# EAGLE design Garage_Door_Controller (EAGLE 9.6.2)
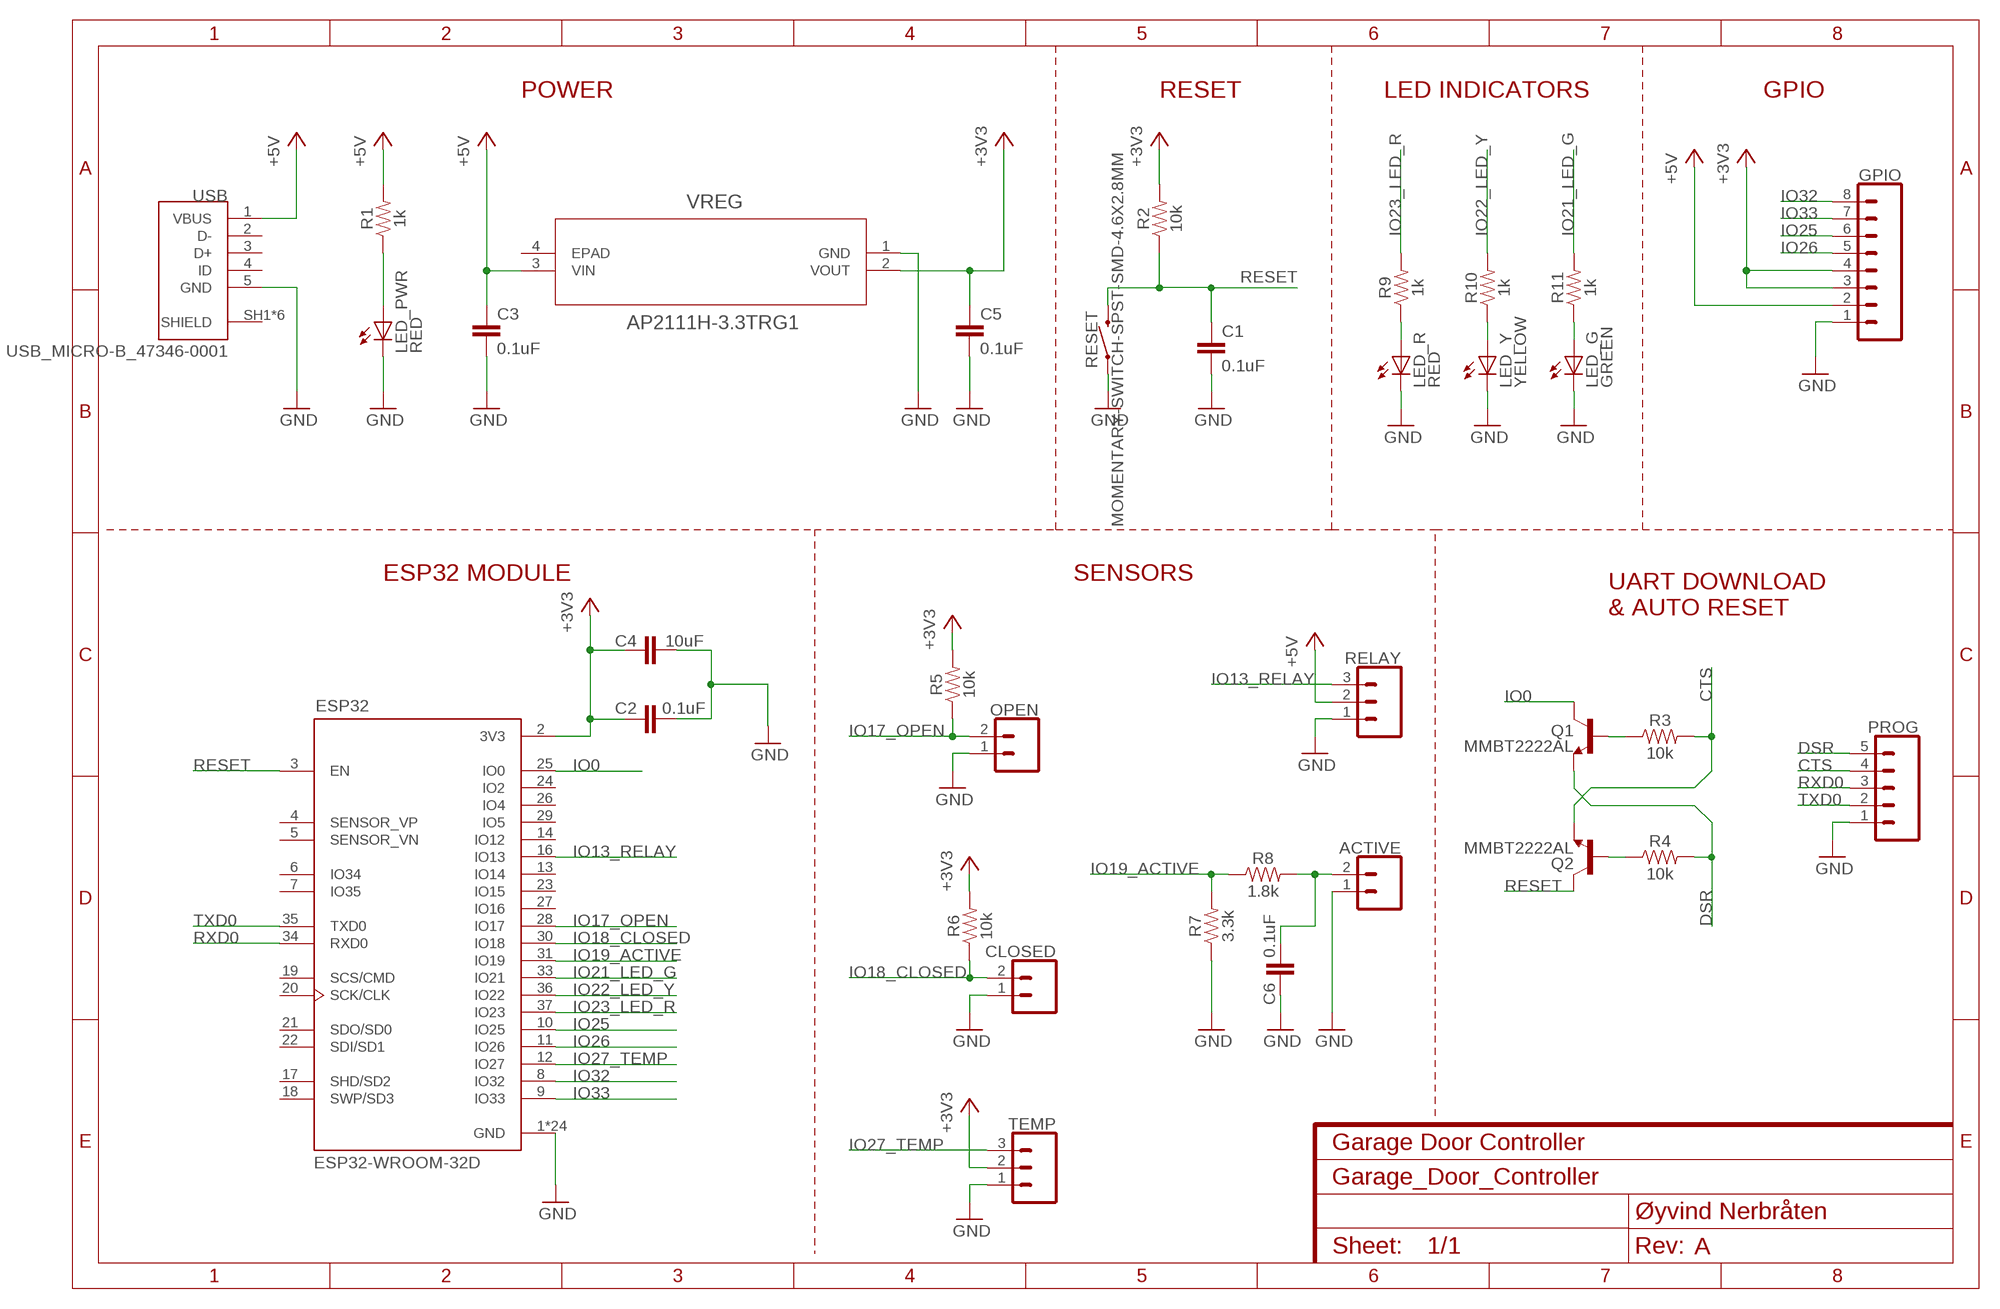
[diagram p0: schematic, sheet 1]
FRAME1 (FRAME-A4L): CNAME: Garage Door Controller; CREVISION: A; DESIGNER: Øyvind Nerbråten; REV: 1

## Parts
ACTIVE  CONN_02  [1X02]
C1  0.1uF  0.1UF-0603-25V-5%  [0603]
C2  0.1uF  0.1UF-0603-25V-5%  [0603]
C3  0.1uF  0.1UF-0603-25V-5%  [0603]
C4  10uF  10UF-0805-10V-10%  [0805]
C5  0.1uF  0.1UF-0603-25V-5%  [0603]
C6  0.1uF  0.1UF-0603-25V-5%  [0603]
CLOSED  CONN_02  [1X02]
ESP32  ESP32-WROOM-32D  [ESP32-WROOM-32D]
GPIO  CONN_08"  [1X08]
LED_G  GREEN  LEDCHIPLED_0805  [CHIPLED_0805]
LED_PWR  RED  LEDCHIPLED_0805  [CHIPLED_0805]
LED_R  RED  LEDCHIPLED_0805  [CHIPLED_0805]
LED_Y  YELLOW  LEDCHIPLED_0805  [CHIPLED_0805]
OPEN  CONN_02  [1X02]
PROG  CONN_05  [1X05]
Q1  MMBT2222AL  TRANS_NPN-MMBT2222AL  [SOT23-3]
Q2  MMBT2222AL  TRANS_NPN-MMBT2222AL  [SOT23-3]
R1  1k  1KOHM-0603-1/10W-1%  [0603]
R2  10k  10KOHM-0603-1/10W-1%  [0603]
R3  10k  10KOHM-0603-1/10W-1%  [0603]
R4  10k  10KOHM-0603-1/10W-1%  [0603]
R5  10k  10KOHM-0603-1/10W-1%  [0603]
R6  10k  10KOHM-0603-1/10W-1%  [0603]
R7  3.3k  3.3KOHM-0603-1/10W-1%  [0603]
R8  1.8k  1.8KOHM-0603-1/10W-1%  [0603]
R9  1k  1KOHM-0603-1/10W-1%  [0603]
R10  1k  1KOHM-0603-1/10W-1%  [0603]
R11  1k  1KOHM-0603-1/10W-1%  [0603]
RELAY  CONN_03  [1X03]
RESET  MOMENTARY-SWITCH-SPST-SMD-4.6X2.8MM  [TACTILE_SWITCH_SMD_4.6X2.8MM]
TEMP  CONN_03  [1X03]
USB  USB_MICRO-B_47346-0001  [MOLEX_47346-0001]
VREG  AP2111H-3.3TRG1  [SOT-223_DIO]

## Nets
+3V3: C2.1 C4.1 C5.1 ESP32.2(3V3) GPIO.3 GPIO.4 R2.2 R5.2 R6.2 TEMP.2 VREG.2(VOUT)
+5V: C3.1 GPIO.2 R1.2 RELAY.2 USB.1(VBUS) VREG.3(VIN)
CTS: PROG.4 Q2.2(E) R3.2
DSR: PROG.5 Q1.2(E) R4.2
GND: ACTIVE.1 C1.2 C2.2 C3.2 C4.2 C5.2 C6.1 CLOSED.1 ESP32.1(GND) ESP32.15(GND) ESP32.38(GND) ESP32.39_1(GND) ESP32.39_2(GND) ESP32.39_3(GND) ESP32.39_4(GND) ESP32.39_5(GND) ESP32.39_6(GND) ESP32.39_7(GND) ESP32.39_8(GND) ESP32.39_9(GND) ESP32.39_10(GND) ESP32.39_11(GND) ESP32.39_12(GND) ESP32.39_13(GND) ESP32.39_14(GND) ESP32.39_15(GND) ESP32.39_16(GND) ESP32.39_17(GND) ESP32.39_18(GND) ESP32.39_19(GND) ESP32.39_20(GND) ESP32.39_21(GND) GPIO.1 LED_G.C LED_PWR.C LED_R.C LED_Y.C OPEN.1 PROG.1 R7.1 RELAY.1 RESET.1 RESET.2 TEMP.1 USB.5(GND) VREG.1(GND)
IO0: ESP32.25(IO0) Q1.3(C)
IO13_RELAY: ESP32.16(IO13) RELAY.3
IO17_OPEN: ESP32.28(IO17) OPEN.2 R5.1
IO18_CLOSED: CLOSED.2 ESP32.30(IO18) R6.1
IO19_ACTIVE: ESP32.31(IO19) R7.2 R8.1
IO21_LED_G: ESP32.33(IO21) R11.2
IO22_LED_Y: ESP32.36(IO22) R10.2
IO23_LED_R: ESP32.37(IO23) R9.2
IO25: ESP32.10(IO25) GPIO.6
IO26: ESP32.11(IO26) GPIO.5
IO27_TEMP: ESP32.12(IO27) TEMP.3
IO32: ESP32.8(IO32) GPIO.8
IO33: ESP32.9(IO33) GPIO.7
N$1: LED_PWR.A R1.1
N$2: Q1.1(B) R3.1
N$3: Q2.1(B) R4.1
N$4: ACTIVE.2 C6.2 R8.2
N$5: LED_R.A R9.1
N$6: LED_Y.A R10.1
N$7: LED_G.A R11.1
RESET: C1.1 ESP32.3(EN) Q2.3(C) R2.1 RESET.3 RESET.4
RXD0: ESP32.34(RXD0) PROG.3
TXD0: ESP32.35(TXD0) PROG.2
Unconnected: ESP32.4(SENSOR_VP) ESP32.5(SENSOR_VN) ESP32.6(IO34) ESP32.7(IO35) ESP32.13(IO14) ESP32.14(IO12) ESP32.17(SHD/SD2) ESP32.18(SWP/SD3) ESP32.19(SCS/CMD) ESP32.20(SCK/CLK) ESP32.21(SDO/SD0) ESP32.22(SDI/SD1) ESP32.23(IO15) ESP32.24(IO2) ESP32.26(IO4) ESP32.27(IO16) ESP32.29(IO5) USB.2(D-) USB.3(D+) USB.4(ID) USB.SH1(SHIELD) USB.SH2(SHIELD) USB.SH3(SHIELD) USB.SH4(SHIELD) USB.SH5(SHIELD) USB.SH6(SHIELD) VREG.4(EPAD)

## Notes on the sheet
- POWER | RESET | LED INDICATORS | GPIO
- ESP32 MODULE | SENSORS
- UART DOWNLOAD
  & AUTO RESET

## Library data of the parts
ACTIVE CLOSED OPEN = SparkFun-Connectors:CONN_02: Multi connection point. Often used as Generic Header-pin footprint for 0.1 inch spaced/style header connections On any of the 0.1 inch spaced packages, you can populate with these: Break Away Headers - Straight <https://www.sparkfun.com/products/116> (PRT-00116) Break Away Male Headers - Right Angle <https://www.sparkfun.com/products/553> (PRT-00553) Female Headers <https://www.sparkfun.com/products/115> (PRT-00115) Break Away Headers - Machine Pin <https://www.sparkfun.com/products/117> (PRT-00117) Break Away Female Headers - Swiss Machine Pin <https://www.sparkfun.com/products/743> (PRT-00743) For SCREWTERMINALS and SPRING TERMINALS visit here: Screw Terimnals on SparkFun.com <https://www.sparkfun.com/search/results?term=Screw+Terminals> (5mm/3.5mm/2.54mm spacing) This device is also useful as a general connection point to wire up your design to another part of your project. Our various solder wires solder well into these plated through hole pads. Hook-Up Wire - Assortment (Stranded, 22 AWG) <https://www.sparkfun.com/products/11375> (PRT-11375) Hook-Up Wire - Assortment (Solid Core, 22 AWG) <https://www.sparkfun.com/products/11367> (PRT-11367) View the entire wire category on our website here <https://www.sparkfun.com/categories/141> Special notes: Molex polarized connector foot print use with: PRT-08233 with associated crimp pins and housings. 2.54_SCREWTERM for use with PRT-10571. 3.5mm Screw Terminal footprints for PRT-08084 5mm Screw Terminal footprints for use with PRT-08432
C1-C3 C5 C6 = SparkFun-Capacitors:0.1UF: 0.1µF ceramic capacitors A capacitor is a passive two-terminal electrical component used to store electrical energy temporarily in an electric field.; PROD_ID: CAP-08604
C4 = SparkFun-Capacitors:10UF: 10.0µF ceramic capacitors A capacitor is a passive two-terminal electrical component used to store electrical energy temporarily in an electric field.; PROD_ID: CAP-11330
ESP32 = IC-Microcontroller:ESP32-WROOM-32D: Bluetooth, WiFi 802.11b/g/n, Bluetooth v4.2 + EDR, Class 1, 2 and 3 Transceiver Module 2.4GHz ~ 2.5GHz Integrated, Trace Surface Mount; AVAILABILITY: Unavailable; DESCRIPTION: Bluetooth, WiFi 802.11b/g/n, Bluetooth v4.2 + EDR, Class 1, 2 and 3 Transceiver Module 2.4GHz ~ 2.5GHz Integrated, Trace Surface Mount; MF: Espressif Systems; MP: ESP32-WROOM-32D; PACKAGE: Module Espressif Systems; PRICE: None
GPIO = SparkFun-Connectors:CONN_08: Multi connection point. Often used as Generic Header-pin footprint for 0.1 inch spaced/style header connections On any of the 0.1 inch spaced packages, you can populate with these: Break Away Headers - Straight <https://www.sparkfun.com/products/116> (PRT-00116) Break Away Male Headers - Right Angle <https://www.sparkfun.com/products/553> (PRT-00553) Female Headers <https://www.sparkfun.com/products/115> (PRT-00115) Break Away Headers - Machine Pin <https://www.sparkfun.com/products/117> (PRT-00117) Break Away Female Headers - Swiss Machine Pin <https://www.sparkfun.com/products/743> (PRT-00743) Arduino Stackable Header - 8 Pin <https://www.sparkfun.com/products/9279> (PRT-09279) For SCREWTERMINALS and SPRING TERMINALS visit here: Screw Terimnals on SparkFun.com <https://www.sparkfun.com/search/results?term=Screw+Terminals> (5mm/3.5mm/2.54mm spacing) This device is also useful as a general connection point to wire up your design to another part of your project. Our various solder wires solder well into these plated through hole pads. Hook-Up Wire - Assortment (Stranded, 22 AWG) <https://www.sparkfun.com/products/11375> (PRT-11375) Hook-Up Wire - Assortment (Solid Core, 22 AWG) <https://www.sparkfun.com/products/11367> (PRT-11367) View the entire wire category on our website here <https://www.sparkfun.com/categories/141> Special notes: Molex polarized connector foot print use with SKU : PRT-08231 with associated crimp pins and housings. 1MM SMD Version SKU: PRT-10208 NOTES ON THE VARIANTS LOCK and LOCK_LONGPADS... This footprint was designed to help hold the alignment of a through-hole component (i.e. 6-pin header) while soldering it into place. You may notice that each hole has been shifted either up or down by 0.005 of an inch from it's more standard position (which is a perfectly straight line). This slight alteration caused the pins (the squares in the middle) to touch the edges of the holes. Because they are alternating, it causes a "brace" to hold the component in place. 0.005 has proven to be the perfect amount of "off-center" position when using our standard breakaway headers. Although looks a little odd when you look at the bare footprint, once you have a header in there, the alteration is very hard to notice. Also,if you push a header all the way into place, it is covered up entirely on the bottom side.; PROD_ID: CONN-08438
LED_G LED_PWR LED_R LED_Y = adafruit:LED: LED OSRAM: - CHIPLED LG R971, LG N971, LY N971, LG Q971, LY Q971, LO R971, LY R971 LH N974, LH R974 LS Q976, LO Q976, LY Q976 LO Q996 - Hyper CHIPLED LW Q18S LB Q993, LB Q99A, LB R99A - SideLED LS A670, LO A670, LY A670, LG A670, LP A670 LB A673, LV A673, LT A673, LW A673 LH A674 LY A675 LS A676, LA A676, LO A676, LY A676, LW A676 LS A679, LY A679, LG A679 - Hyper Micro SIDELED® LS Y876, LA Y876, LO Y876, LY Y876 LT Y87S - SmartLED LW L88C, LW L88S LB L89C, LB L89S, LG L890 LS L89K, LO L89K, LY L89K LS L896, LA L896, LO L896, LY L896 - TOPLED LS T670, LO T670, LY T670, LG T670, LP T670 LSG T670, LSP T670, LSY T670, LOP T670, LYG T670 LG T671, LOG T671, LSG T671 LB T673, LV T673, LT T673, LW T673 LH T674 LS T676, LA T676, LO T676, LY T676, LB T676, LH T676, LSB T676, LW T676 LB T67C, LV T67C, LT T67C, LS T67K, LO T67K, LY T67K, LW E67C LS E67B, LA E67B, LO E67B, LY E67B, LB E67C, LV E67C, LT E67C LW T67C LS T679, LY T679, LG T679 LS T770, LO T770, LY T770, LG T770, LP T770 LB T773, LV T773, LT T773, LW T773 LH T774 LS E675, LA E675, LY E675, LS T675 LS T776, LA T776, LO T776, LY T776, LB T776 LHGB T686 LT T68C, LB T68C - Hyper Mini TOPLED® LB M676 - Mini TOPLED Santana® LG M470 LS M47K, LO M47K, LY M47K Source: http://www.osram.convergy.de/
PROG = SparkFun-Connectors:CONN_05: Multi connection point. Often used as Generic Header-pin footprint for 0.1 inch spaced/style header connections On any of the 0.1 inch spaced packages, you can populate with these: Break Away Headers - Straight <https://www.sparkfun.com/products/116> (PRT-00116) Break Away Male Headers - Right Angle <https://www.sparkfun.com/products/553> (PRT-00553) Female Headers <https://www.sparkfun.com/products/115> (PRT-00115) Break Away Headers - Machine Pin <https://www.sparkfun.com/products/117> (PRT-00117) Break Away Female Headers - Swiss Machine Pin <https://www.sparkfun.com/products/743> (PRT-00743) For SCREWTERMINALS and SPRING TERMINALS visit here: Screw Terimnals on SparkFun.com <https://www.sparkfun.com/search/results?term=Screw+Terminals> (5mm/3.5mm/2.54mm spacing) This device is also useful as a general connection point to wire up your design to another part of your project. Our various solder wires solder well into these plated through hole pads. Hook-Up Wire - Assortment (Stranded, 22 AWG) <https://www.sparkfun.com/products/11375> (PRT-11375) Hook-Up Wire - Assortment (Solid Core, 22 AWG) <https://www.sparkfun.com/products/11367> (PRT-11367) View the entire wire category on our website here <https://www.sparkfun.com/categories/141> Special notes: Molex polarized connector foot print use with SKU : PRT-08231 with associated crimp pins and housings. 1MM SMD Version SKU: PRT-10208
Q1 Q2 = SparkFun-DiscreteSemi:TRANS_NPN: NPN transistor Current controlled devices typically used to amplify current or used as a switch. BC547 - COM-08928 <http://www.sparkfun.com/products/8928> (TO-92 45V 100mA) (1.Collector 2.Base 3.Emitter) 2N3904 - COM-00521 <http://www.sparkfun.com/products/521> (TO-92 40V 200mA) (1.Emitter 2.Base 3.Collector) P2N2222A - COM-12852 <http://www.sparkfun.com/products/12852> (TO-92 40V 600mA) (1.Collector 2.Base 3.Emitter); PROD_ID: TRANS-08049; VALUE: 600mA/40V
R1 R9-R11 = SparkFun-Resistors:1KOHM: 1kΩ resistor A resistor is a passive two-terminal electrical component that implements electrical resistance as a circuit element. Resistors act to reduce current flow, and, at the same time, act to lower voltage levels within circuits. - Wikipedia; PROD_ID: RES-07856
R2-R6 = SparkFun-Resistors:10KOHM: 10kΩ resistor A resistor is a passive two-terminal electrical component that implements electrical resistance as a circuit element. Resistors act to reduce current flow, and, at the same time, act to lower voltage levels within circuits. - Wikipedia; PROD_ID: RES-00824
R7 = SparkFun-Resistors:3.3KOHM: 3.3kΩ resistor A resistor is a passive two-terminal electrical component that implements electrical resistance as a circuit element. Resistors act to reduce current flow, and, at the same time, act to lower voltage levels within circuits. - Wikipedia; PROD_ID: RES-07851
R8 = SparkFun-Resistors:1.8KOHM: 1.8kΩ resistor A resistor is a passive two-terminal electrical component that implements electrical resistance as a circuit element. Resistors act to reduce current flow, and, at the same time, act to lower voltage levels within circuits. - Wikipedia; PROD_ID: RES-09119
RELAY TEMP = SparkFun-Connectors:CONN_03: Multi connection point. Often used as Generic Header-pin footprint for 0.1 inch spaced/style header connections On any of the 0.1 inch spaced packages, you can populate with these: Break Away Headers - Straight <https://www.sparkfun.com/products/116> (PRT-00116) Break Away Male Headers - Right Angle <https://www.sparkfun.com/products/553> (PRT-00553) Female Headers <https://www.sparkfun.com/products/115> (PRT-00115) Break Away Headers - Machine Pin <https://www.sparkfun.com/products/117> (PRT-00117) Break Away Female Headers - Swiss Machine Pin <https://www.sparkfun.com/products/743> (PRT-00743) Stackable Header - 3 Pin (Female, 0.1") <https://www.sparkfun.com/products/13875> (PRT-13875) For SCREWTERMINALS and SPRING TERMINALS visit here: Screw Terimnals on SparkFun.com <https://www.sparkfun.com/search/results?term=Screw+Terminals> (5mm/3.5mm/2.54mm spacing) This device is also useful as a general connection point to wire up your design to another part of your project. Our various solder wires solder well into these plated through hole pads. Hook-Up Wire - Assortment (Stranded, 22 AWG) <https://www.sparkfun.com/products/11375> (PRT-11375) Hook-Up Wire - Assortment (Solid Core, 22 AWG) <https://www.sparkfun.com/products/11367> (PRT-11367) View the entire wire category on our website here <https://www.sparkfun.com/categories/141> Special notes: Molex polarized connector foot print use with SKU : PRT-08232 with associated crimp pins and housings.
RESET = SparkFun-Switches:MOMENTARY-SWITCH-SPST: Momentary Switch (Pushbutton) - SPST Normally-open (NO) SPST momentary switches (buttons, pushbuttons). Variants PTH-12MM - 12mm square, through-hole Momentary Pushbutton Switch - 12mm Square <https://www.sparkfun.com/products/9190> (COM-09190) PTH-6.0MM, PTH-6.0MM-KIT - 6.0mm square, through-hole Mini Pushbutton Switch <https://www.sparkfun.com/products/97> (COM-00097) KIT package intended for soldering kit's - only one side of pads' copper is exposed. PTH-RIGHT-ANGLE-KIT - Right-angle, through-hole Right Angle Tactile Button <https://www.sparkfun.com/products/10791> - Used on SparkFun BigTime Watch Kit <https://www.sparkfun.com/products/11734> SMD-12MM - 12mm square, surface-mount Tactile Button - SMD (12mm) <https://www.sparkfun.com/products/12993> (COM-12993) Used on SparkFun PicoBoard <https://www.sparkfun.com/products/11888> SMD-4.5MM - 4.5mm Square Trackball Switch Used on SparkFun Blackberry Trackballer Breakout <https://www.sparkfun.com/products/13169> SMD-4.6MMX2.8MM - 4.60mm x 2.80mm, surface mount Used on SparkFun SAMD21 Mini Breakout <https://www.sparkfun.com/products/13664> SMD-5.2MM, SMD-5.2-REDUNDANT - 5.2mm square, surface-mount Mini Pushbutton Switch - SMD <https://www.sparkfun.com/products/8720> (COM-08720) Used on Arduino Pro Mini <https://www.sparkfun.com/products/11114> REDUNDANT package connects both switch circuits together SMD-6.0X3.5MM - 6.0 x 3.5mm, surface mount Momentary Reset Switch SMD <https://www.sparkfun.com/products/8229> (COM-08229) SMD-6.2MM-TALL - 6.2mm square, surface mount Tactile Button - SMD (6mm) <https://www.sparkfun.com/products/12992> Used on SparkFun Digital Sandbox <https://www.sparkfun.com/products/12651> SMD-RIGHT-ANGLE - Right-angle, surface mount Used on SparkFun Block for Intel® Edison - Arduino <https://www.sparkfun.com/products/13036>; PROD_ID: SWCH-13065
USB = Connectors:USB_MICRO-B_47346-0001: CONN RCPT 5POS MICRO USB R/A SMD; AVAILABILITY: Unavailable; DESCRIPTION: USB - micro B USB 2.0 Receptacle Connector 5 Position Surface Mount, Right Angle; MF: Molex; MOUSER-PURCHASE-URL: https://snapeda.com/shop?store=Mouser&id=53503; MP: 47346-0001; PACKAGE: None; PRICE: None
VREG = IC-Power:AP2111H-3.3TRG1; BUILT_BY: EMA_UL_Team; MANUFACTURER_PART_NUMBER: AP2111H-3.3TRG1; SOURCELIBRARY: DIODESINC_2_2015-08-18; VENDOR: Diodes Inc

## Board
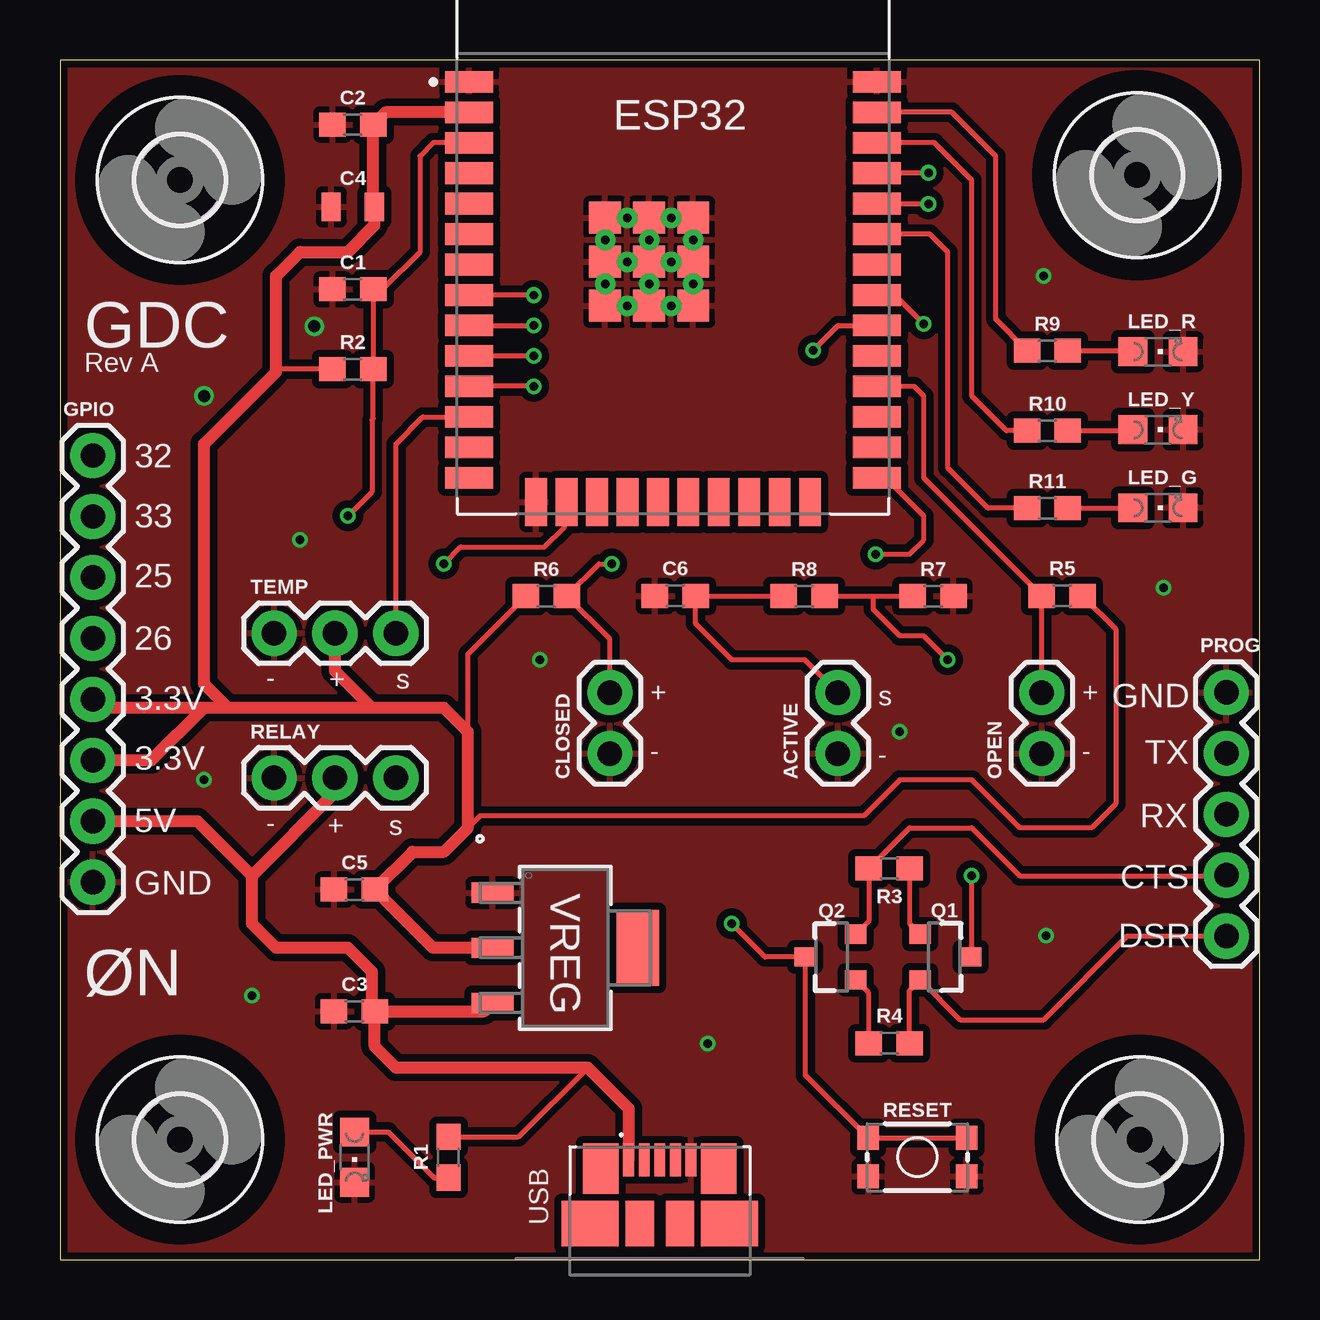
[diagram p1: board, top side]
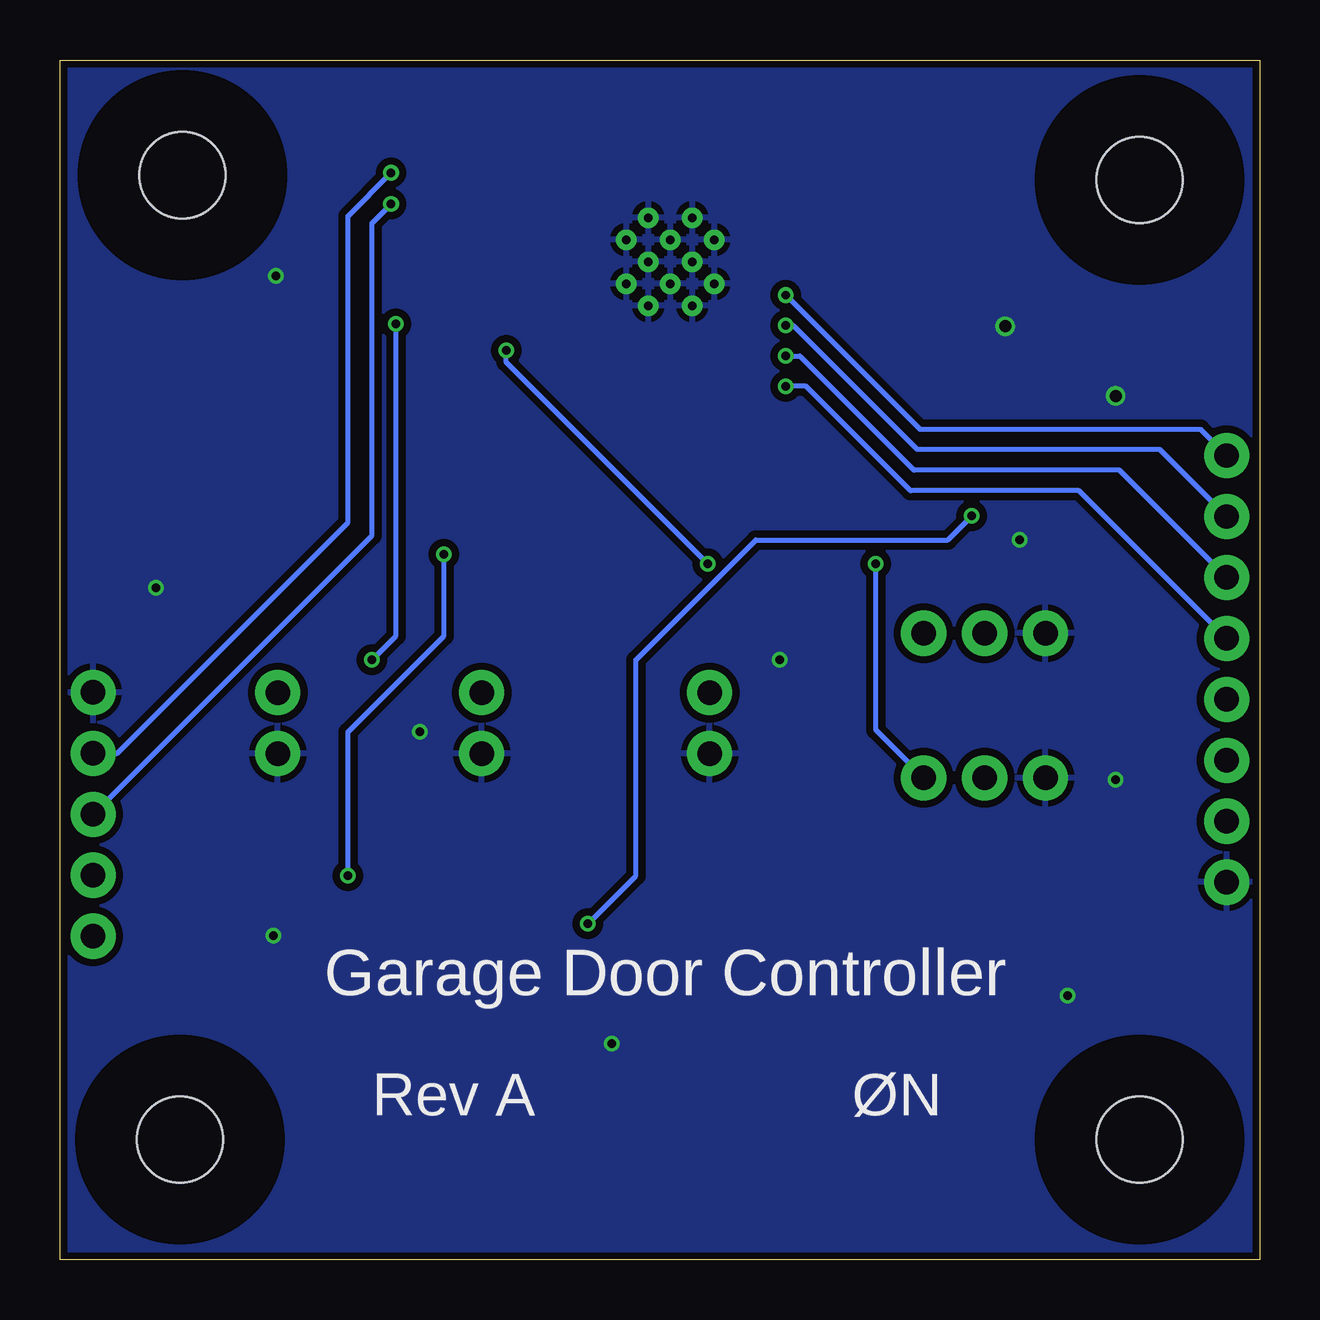
[diagram p2: board, bottom side, seen from below]

Size 50 x 50 mm. Coordinates in mm from the lower left corner, seen from the top.
Outline: 0,0 50,0 50,50 0,50 0,0
Copper layers (1*16): Top 0.035mm / dielectric 1.5mm / Bottom 0.035mm
Design rules "dirt_cheap_dirty_boards.v1.1": minimum track width 6mil, minimum drill 12mil, track to track 6mil, track to pad 6mil, pad to pad 6mil, via to via 6mil, smd to smd 0mil, copper to edge 10mil, drill to drill 10mil, minimum pad ring 10mil, minimum via ring 6mil, stop-mask expansion 2mil, vias tented up to drill 25mil, thermal gap 10mil

### Footprints (pad centres in the part's own frame; a part is rotated, then mirrored left to right if it is on the bottom)
1X02 = drill 1.016 pad 1.88: 1 0,0; 2 2.54,0
0603 = smd 1.1 x 1: 1 -0.85,0; 2 0.85,0
0805 = smd 0.8 x 1.2: 1 -0.9,0; 2 0.9,0
ESP32-WROOM-32D = smd 2 x 0.9: 1 -8.5,5.26; 2 -8.5,3.99; 3 -8.5,2.72; 4 -8.5,1.45; 5 -8.5,0.18; 6 -8.5,-1.09; 7 -8.5,-2.36; 8 -8.5,-3.63; 9 -8.5,-4.9; 10 -8.5,-6.17; 11 -8.5,-7.44; 12 -8.5,-8.71; 13 -8.5,-9.98; 14 -8.5,-11.25; 25 8.5,-11.25; 26 8.5,-9.98; 27 8.5,-8.71; 28 8.5,-7.44; 29 8.5,-6.17; 30 8.5,-4.9; 31 8.5,-3.63; 32 8.5,-2.36; 33 8.5,-1.09; 34 8.5,0.18; 35 8.5,1.45; 36 8.5,2.72; 37 8.5,3.99; 38 8.5,5.26 | smd 0.9 x 2: 15 -5.715,-12.25; 16 -4.445,-12.25; 17 -3.175,-12.25; 18 -1.905,-12.25; 19 -0.635,-12.25; 20 0.635,-12.25; 21 1.905,-12.25; 22 3.175,-12.25; 23 4.445,-12.25; 24 5.715,-12.25 | smd 1.33 x 1.33: 39_1 -2.835,-0.405; 39_2 -1,-0.405; 39_3 0.835,-0.405; 39_4 -2.835,-2.24; 39_5 -1,-2.24; 39_6 0.835,-2.24; 39_7 -2.835,-4.075; 39_8 -1,-4.075; 39_9 0.835,-4.075 | drill 0.35: 39_10 -1.917,-0.405; 39_11 -0.083,-0.405; 39_12 -2.835,-1.323; 39_13 -1,-1.323; 39_14 0.835,-1.323; 39_15 -1.917,-2.24; 39_16 -0.083,-2.24; 39_17 -2.835,-3.158; 39_18 -1,-3.158; 39_19 0.835,-3.158; 39_20 -1.917,-4.075; 39_21 -0.083,-4.075
1X08 = drill 1.016 pad 1.88: 1 0,0; 2 2.54,0; 3 5.08,0; 4 7.62,0; 5 10.16,0; 6 12.7,0; 7 15.24,0; 8 17.78,0
CHIPLED_0805 = smd 1.2 x 1.2: A 0,-1.05; C 0,1.05
1X05 = drill 1.016 pad 1.88: 1 0,0; 2 2.54,0; 3 5.08,0; 4 7.62,0; 5 10.16,0
SOT23-3 = smd 0.8 x 0.9: 1 -0.95,-1; 2 0.95,-1; 3 0,1.1
1X03 = drill 1.016 pad 1.88: 1 0,0; 2 2.54,0; 3 5.08,0
TACTILE_SWITCH_SMD_4.6X2.8MM = smd 0.9 x 1: 1 -2.05,-0.8; 2 2.05,-0.8; 3 2.05,0.8; 4 -2.05,0.8
3,6 = hole 3.6: 0,0
MOLEX_47346-0001 = smd 0.45 x 1.38: 1 -1.3,2.66; 2 -0.65,2.66; 3 0,2.66; 4 0.65,2.66; 5 1.3,2.66 | smd 1.475 x 2.1: SH1 -2.462,2.3; SH2 2.462,2.3 | smd 2.375 x 1.9: SH3 -2.913,0; SH6 2.913,0 | smd 1.175 x 1.9: SH4 -0.838,0; SH5 0.838,0
SOT-223_DIO = smd 0.851 x 1.761: 1 -2.3,-3.025; 2 0,-3.025; 3 2.3,-3.025 | smd 3.151 x 1.761: 4 0,3.025

### Placement (x,y rotation side)
ACTIVE  32.42,21.09 90 top
C1  12.21,40.45 180 top
C2  12.21,47.31 180 top
C3  12.27,10.35 180 top
C4  12.21,43.88 180 top
C5  12.27,15.43 180 top
C6  25.65,27.65 0 top
CLOSED  22.92,21.09 90 top
ESP32  25.56,43.83 0 top
GPIO  1.37,15.73 90 top
LED_G  45.77,31.34 270 top
LED_PWR  12.28,4.27 180 top
LED_R  45.77,37.84 270 top
LED_Y  45.77,34.59 270 top
OPEN  40.92,21.09 90 top
PROG  48.62,23.64 270 top
Q1  36.86,12.61 270 top
Q2  32.17,12.61 90 top
R1  16.2,4.27 90 top
R2  12.21,37.11 180 top
R3  34.57,16.31 180 top
R4  34.57,9.01 0 top
R5  41.77,27.65 0 top
R6  20.27,27.65 180 top
R7  36.4,27.65 180 top
R8  31.02,27.65 180 top
R9  41.16,37.88 180 top
R10  41.16,34.55 180 top
R11  41.16,31.32 180 top
RELAY  8.92,20.08 0 top
RESET  35.74,4.27 0 top
TEMP  8.92,26.11 0 top
U$1  [3,6]  5,5 0 top
U$2  [3,6]  45,5 0 top
U$3  [3,6]  44.9,45.2 0 top
U$4  [3,6]  5,45 0 top
USB  25,1.5 0 top
VREG  21.06,12.99 270 top

### Tracks (layer width: path | path; a pad name or v marks a point on that pad's centre or on a via)
+3V3
  Top 0.2: R2.2 9.12,37.12 9,37 | 17,22 17,25.23 R6.2 | R5.2 44,26.28 44,19 43,18 40,18 38,20 35,20 33.5,18.5 17.5,18.5 17,18
  Top 0.508: VREG.2 18.02,13 15.55,13 C5.1 14.7,17 16,17 17,18 17,22 16,23 13,23 | 13,23 11.46,24.54 TEMP.2 | 13,23 7,23 | 7,23 6,23 | 6,23 1.72,23 GPIO.4 | 6,23 3.81,20.81 GPIO.3 | 7,23 6,24 6,34 9,37 9,41 10,42 12,42 13.11,43.11 C4.1 13.06,43.93 C2.1 13.57,47.82 ESP32.2
+5V
  Top 0.2: R1.2 19.12,5.12 22,8
  Top 0.508: C3.1 13.12,8.88 14,8 22,8 23.7,6.3 USB.1 | C3.1 17.7,10.35 VREG.3 | C3.1 13,10.47 13,12 12,13 9,13 8,14 8,16 | 8,16 5.73,18.27 GPIO.2 | 8,16 11.46,19.46 RELAY.2
CTS
  Top 0.2: Q2.2 33.72,14.11 R3.2 35.41,18 38,18 40,16 48.6,16 PROG.4
DSR
  Top 0.2: R4.2 35.42,11.22 Q1.2 37.52,10 41,10 44.48,13.48 PROG.5
GND  (via drill 0.35, 0.5)
  other vias: 10.6,38.9 41.1,13.5 27,9 46,28 6,36 10,30 20,25 35,22 8,11 41,41 6,20
  pour Top (isolate 0.305): 0,0 0,50 50,50 50,0
  pour Bottom (isolate 0.305): 0,0 0,50 50,50 50,0
IO0  (via drill 0.35)
  Top 0.2: Q1.3 38,12.65 v38,16 | v34,29.4 35.4,29.4 36,30 36,31 34.42,32.58 ESP32.25
  Bottom 0.2: v38,16 38,22 34,26 v34,29.4
IO13_RELAY  (via drill 0.35)
  Top 0.2: v16,29 16.7,29.7 20.2,29.7 21,30.5 21,31.46 ESP32.16
  Bottom 0.2: RELAY.3 16,22.08 v16,29
IO17_OPEN
  Top 0.2: OPEN.2 R5.1 36,32.58 36,36 35.61,36.39 ESP32.28
IO18_CLOSED  (via drill 0.35)
  Top 0.2: CLOSED.2 22.92,25.86 R6.1 22.47,29 v23,29 | v31.4,37.9 32.43,38.93 ESP32.30
  Bottom 0.2: v23,29 31.4,37.4 v31.4,37.9
IO19_ACTIVE  (via drill 0.35)
  Top 0.2: R8.1 33.9,27.65 | 33.9,27.65 R7.2 | v37,25 36,26 35,26 33.9,27.1 33.9,27.65 | ESP32.31 34.8,40.2 v36,39
  Bottom 0.2: v37,25 36,26 v36,39
IO21_LED_G
  Top 0.2: R11.2 38.68,31.32 37,33 37,42 36.26,42.74 ESP32.33
IO22_LED_Y
  Top 0.2: R10.2 39.45,34.55 38,36 38,45 36.45,46.55 ESP32.36
IO23_LED_R
  Top 0.2: R9.2 39,39.19 39,46 37.18,47.82 ESP32.37
IO25  (via drill 0.35)
  Top 0.2: v19.75,37.67 ESP32.10
  Bottom 0.2: GPIO.6 5.84,32.9 14.4,32.9 19.17,37.67 v19.75,37.67
IO26  (via drill 0.35)
  Top 0.2: v19.75,36.4 ESP32.11
  Bottom 0.2: GPIO.5 7.53,32.05 14.55,32.05 18.9,36.4 v19.75,36.4
IO27_TEMP
  Top 0.2: TEMP.3 14,34 15.12,35.12 ESP32.12
IO32  (via drill 0.35)
  Top 0.2: v19.75,40.2 ESP32.8 | ESP32.8
  Bottom 0.2: GPIO.8 2.47,34.61 14.16,34.61 v19.75,40.2
IO33  (via drill 0.35)
  Top 0.2: v19.75,38.93 ESP32.9
  Bottom 0.2: GPIO.7 4.18,33.78 14.28,33.78 19.43,38.93 v19.75,38.93
N$1
  Top 0.2: LED_PWR.A 13.68,5.32 15.58,3.42 R1.1
N$2
  Top 0.2: R3.1 35.42,14 Q1.1
N$3
  Top 0.2: R4.1 33.72,11.11 Q2.1
N$4
  Top 0.2: ACTIVE.2 31.05,25 28,25 26.5,26.5 C6.2 R8.2
N$5
  Top 0.2: R9.1 44.67,37.88 LED_R.A
N$6
  Top 0.2: R10.1 44.68,34.55 LED_Y.A
N$7
  Top 0.2: R11.1 44.7,31.32 LED_G.A
RESET  (via drill 0.35)
  Top 0.2: ESP32.3 15.55,46.55 15,46 15,42 13.45,40.45 C1.1 R2.1 13.06,35.06 13,35 13,32 v12,31 | RESET.3 RESET.4 31.07,7.69 Q2.3 29.39,12.61 v28,14
  Bottom 0.2: v28,14 26,16 26,25 21,30 13,30 v12,31
RXD0  (via drill 0.35)
  Top 0.2: v36.2,44 ESP32.34
  Bottom 0.2: PROG.3 37,30.18 37,43.2 v36.2,44
TXD0  (via drill 0.35)
  Top 0.2: v36.2,45.3 36.18,45.28 ESP32.35
  Bottom 0.2: PROG.2 47.62,21.1 38,30.72 38,43.5 v36.2,45.3

### Text on the board
tPlace: GDC | Rev A | 32 | 33 | 25 | 26 | - | + | s | 3.3V | + | s | GND | - | - | TX | 3.3V | 5V | - | + | s | RX | GND | CTS | DSR | ØN
bPlace: Garage Door Controller | ØN | Rev A
tNames: + | -